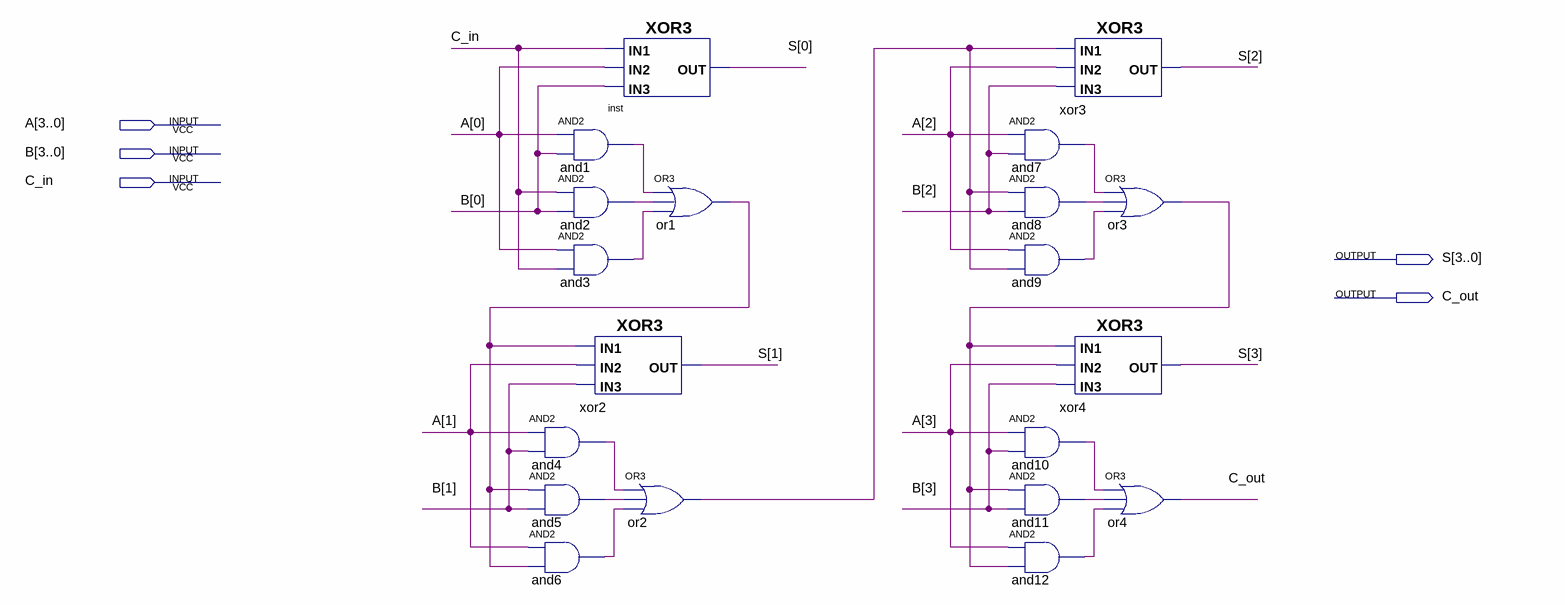
[diagram p0: schematic sheet]
// Quartus schematic sumador4bits.bdf as structural Verilog: 20 symbols, 5 pins
module sumador4bits (
  input  [3:0] A,
  input  [3:0] B,
  input  C_in,
  output [3:0] S,
  output C_out
);

  wire and1_out, and2_out, and3_out, and4_out, and5_out, and6_out, and7_out, and8_out, and9_out, and10_out,
       and11_out, and12_out, or1_out, or2_out, or3_out;

  and and4 (and4_out, A[1], B[1]);
  and and5 (and5_out, or1_out, B[1]);
  and and6 (and6_out, A[1], or1_out);
  XOR3 inst (.IN3(B[0]), .IN1(C_in), .IN2(A[0]), .OUT(S[0]));
  and and1 (and1_out, A[0], B[0]);
  and and2 (and2_out, C_in, B[0]);
  and and3 (and3_out, A[0], C_in);
  XOR3 xor2 (.IN3(B[1]), .IN1(or1_out), .IN2(A[1]), .OUT(S[1]));
  or or1 (or1_out, and1_out, and2_out, and3_out);
  or or2 (or2_out, and4_out, and5_out, and6_out);
  XOR3 xor3 (.IN3(B[2]), .IN1(or2_out), .IN2(A[2]), .OUT(S[2]));
  and and7 (and7_out, A[2], B[2]);
  and and8 (and8_out, or2_out, B[2]);
  and and9 (and9_out, A[2], or2_out);
  XOR3 xor4 (.IN3(B[3]), .IN1(or3_out), .IN2(A[3]), .OUT(S[3]));
  and and10 (and10_out, A[3], B[3]);
  and and11 (and11_out, or3_out, B[3]);
  and and12 (and12_out, A[3], or3_out);
  or or3 (or3_out, and7_out, and8_out, and9_out);
  or or4 (C_out, and10_out, and11_out, and12_out);
endmodule
